# EasyEDA schematic Weather Station.json
TITLE: Weather Station; REV: 1.0; Date: 2017-12-31; Sheet: 1/1; Drawn By: message2prateek
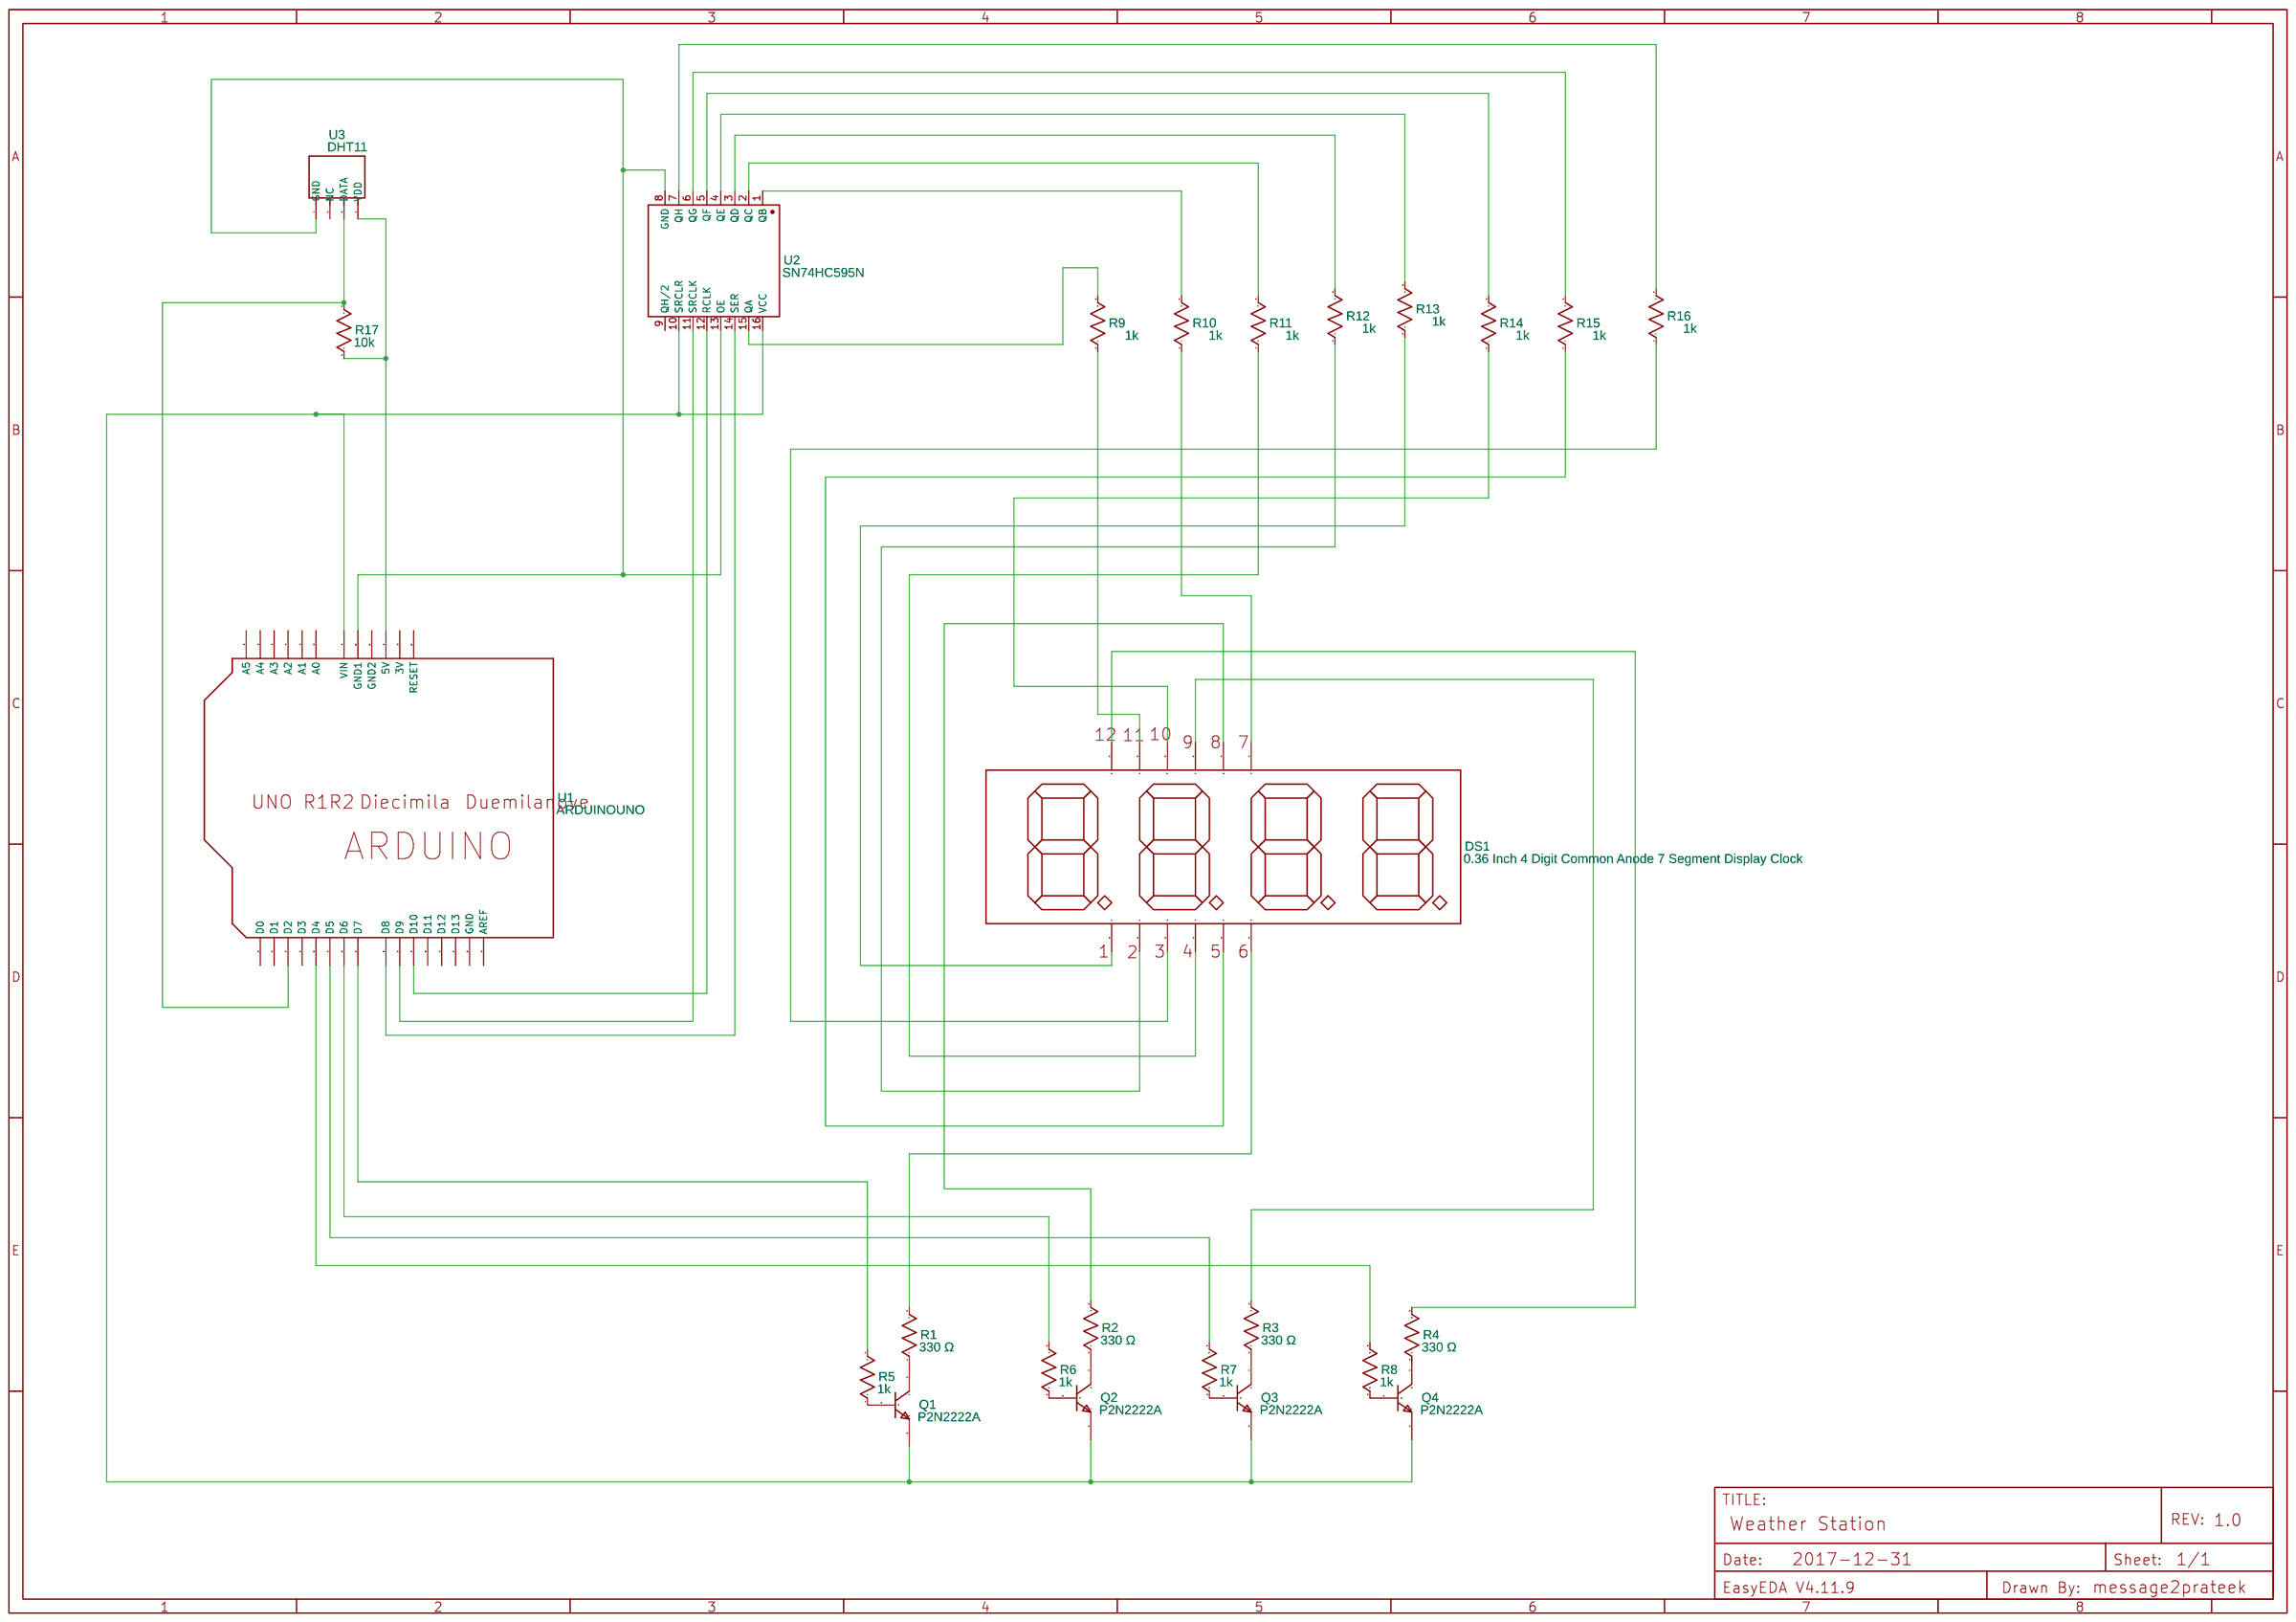
[diagram p0: schematic sheet]

## Parts
DS1  0.36 Inch 4 Digit Common Anode 7 Segment Display Clock  [7 segment]
Q1  P2N2222A  [TO92-INLINE]
Q2  P2N2222A  [TO92-INLINE]
Q3  P2N2222A  [TO92-INLINE]
Q4  P2N2222A  [TO92-INLINE]
R1  330 Ω  [AXIAL-0.3]
R2  330 Ω  [AXIAL-0.3]
R3  330 Ω  [AXIAL-0.3]
R4  330 Ω  [AXIAL-0.3]
R5  1k  [AXIAL-0.3]
R6  1k  [AXIAL-0.3]
R7  1k  [AXIAL-0.3]
R8  1k  [AXIAL-0.3]
R9  1k  [AXIAL-0.3]
R10  1k  [AXIAL-0.3]
R11  1k  [AXIAL-0.3]
R12  1k  [AXIAL-0.3]
R13  1k  [AXIAL-0.3]
R14  1k  [AXIAL-0.3]
R15  1k  [AXIAL-0.3]
R16  1k  [AXIAL-0.3]
R17  10k  [AXIAL-0.3]
U1  ARDUINOUNO  [ARDUINO]
U2  SN74HC595N  [DIP16]
U3  DHT11  [SNR4-2.54-15.5X12.0X5.5MM]

## Library data of the parts
DS1 = -: Contributor: joe5656123
Q1-Q4 = -: Amplifier Transistor NPN Silicon; catid: 20; sourceId: TPVZ40oL8; Manufacturer Part: ?
R1-R17 = Resistor: Manufacturer Part: ?
U1 = -: Arduino DiecimilaDuemilanove; catid: 20; Contributor: Adafruit; Manufacturer Part: ?
U2 = -: Manufacturer Part: ?
U3 = -: DIP Tem-Hum Sensor; catid: 20

## Nets
Net-(DS1-1): DS1.1 R13.1
Net-(DS1-2): DS1.2 R12.1
Net-(DS1-3): DS1.3 R16.1
Net-(DS1-4): DS1.4 R11.1
Net-(DS1-5): DS1.5 R1.2 R15.1
Net-(DS1-6): DS1.6 R4.2
Net-(DS1-8): DS1.8 R10.1
Net-(DS1-9): DS1.9 R2.2
Net-(DS1-10): DS1.10 R3.2
Net-(DS1-11): DS1.11 R14.1
Net-(DS1-12): DS1.12 R9.1
Net-(Q1-1): Q1.1(C) R1.1
Net-(Q1-2): Q1.2(B) R5.1
Net-(Q1-3): Q1.3(E) Q2.3(E) Q3.3(E) Q4.3(E) U1.VIN U2.10(SRCLR) U2.16(VCC)
Net-(Q2-1): Q2.1(C) R2.1
Net-(Q2-2): Q2.2(B) R6.1
Net-(Q3-1): Q3.1(C) R3.1
Net-(Q3-2): Q3.2(B) R7.1
Net-(Q4-2): Q4.2(B) R8.1
Net-(R5-2): R5.2 U1.D7
Net-(R6-2): R6.2 U1.D6
Net-(R7-2): R7.2 U1.D5
Net-(R8-2): R8.2 U1.D4
Net-(R9-2): R9.2 U2.15(QA)
Net-(R10-2): R10.2 U2.1(QB)
Net-(R11-2): R11.2 U2.2(QC)
Net-(R12-2): R12.2 U2.3(QD)
Net-(R13-2): R13.2 U2.4(QE)
Net-(R14-2): R14.2 U2.5(QF)
Net-(R15-2): R15.2 U2.6(QG)
Net-(R16-2): R16.2 U2.7(QH)
Net-(R17-1): R17.1 U1.5V U3.1(VDD)
Net-(R17-2): R17.2 U1.D2 U3.2(DATA)
Net-(U1-D8): U1.D8 U2.14(SER)
Net-(U1-D9): U1.D9 U2.11(SRCLK)
Net-(U1-D10): U1.D10 U2.12(RCLK)
Net-(U1-GND1): U1.GND1 U2.8(GND) U2.13(OE) U3.4(GND)

Not connected (* = marked no-connect by the designer): Q4 1(C); R4 1; U1 3V A0 A1 A2 A3 A4 A5 AREF D0 D1 D3 D11 D12 D13 GND GND2 RESET; U2 9(QH/2); U3 3(NC)
